# Altium project VXL_HT.PrjPCB
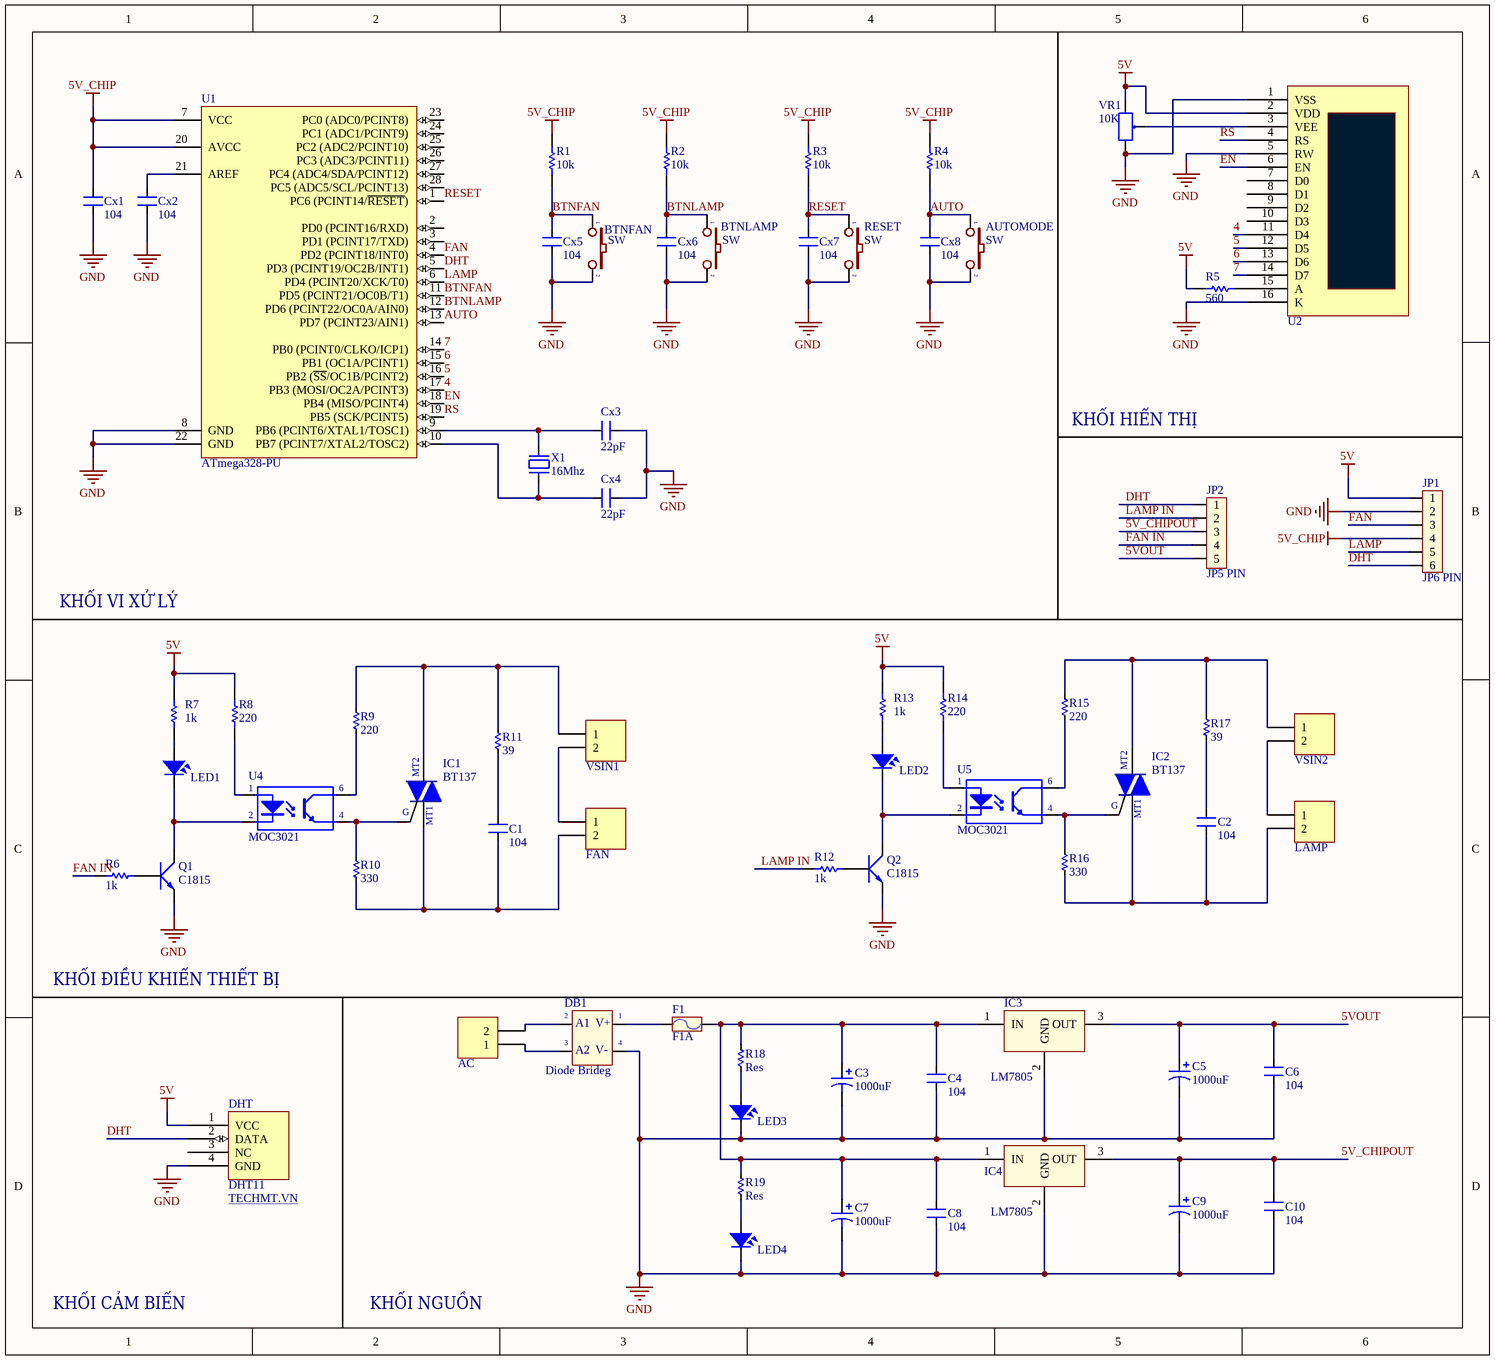
[diagram p0: VXL_HT.SchDoc]
1 sheet, 67 parts. Net scope: global (net labels, ports and power ports of the same name join across sheets).
Board file: PCB1.PcbDoc

## Sheet VXL_HT.SchDoc
size 279 x 254 mm

### Parts
AC  Header 2_1  [HED2]  (value not drawn)
AUTOMODE  SW  [SW2]
BTNFAN  SW  [SW2]
BTNLAMP  SW  [SW2]
C1  104  [CN2]
C2  104  [CN2]
C3  1000uF  [C10mm]
C4  104  [CN2]
C5  1000uF  [C10mm]
C6  104  [CN2]
C7  1000uF  [C10mm]
C8  104  [CN2]
C9  1000uF  [C10mm]
C10  104  [CN2]
Cx1  104  [CN2]
Cx2  104  [CN2]
Cx3  22pF  [CN2]
Cx4  22pF  [CN2]
Cx5  104  [CN2]
Cx6  104  [CN2]
Cx7  104  [CN2]
Cx8  104  [CN2]
DB1  Diode Brideg  [DIO-Bri 5A]
DHT  DHT11  WEB: TECHMT.VN  [DHT11]
F1  F1A  [Fuse]
FAN  Header 2_1  [HED2]  (value not drawn)
IC1  BT137  [QTO-220]
IC2  BT137  [QTO-220]
IC3  LM7805  [QTO-220]
IC4  LM7805  [QTO-220]
JP1  JP6 PIN  [JP6_1]
JP2  JP5 PIN  [JP5]
LAMP  Header 2_1  [HED2]  (value not drawn)
LED1  LED  [LED-5MM-WHITE]  (value not drawn)
LED2  LED  [LED-5MM-WHITE]  (value not drawn)
LED3  LED  [LED-5MM-YELLOW]  (value not drawn)
LED4  LED  [LED-5MM-YELLOW]  (value not drawn)
Q1  C1815  [QTO-92]
Q2  C1815  [QTO-92]
R1  value 10k  [R1/4W]  (hidden comment: Res1)
R2  value 10k  [R1/4W]  (hidden comment: Res1)
R3  value 10k  [R1/4W]  (hidden comment: Res1)
R4  value 10k  [R1/4W]  (hidden comment: Res1)
R5  value 560  [R1/4W]  (hidden comment: Res1)
R6  value 1k  [R1/4W]  (hidden comment: Res1)
R7  value 1k  [R1/4W]  (hidden comment: Res1)
R8  value 220  [R1/4W]  (hidden comment: Res1)
R9  220  [RES-1W]
R10  330  [RES-1W]
R11  39  [RES-1W]
R12  value 1k  [R1/4W]  (hidden comment: Res1)
R13  value 1k  [R1/4W]  (hidden comment: Res1)
R14  value 220  [R1/4W]  (hidden comment: Res1)
R15  220  [RES-1W]
R16  330  [RES-1W]
R17  39  [RES-1W]
R18  Res  [RES-1W]
R19  Res  [RES-1W]
RESET  SW  [SW2]
U1  ATmega328-PU  [DIP28]
U2  LCD  [LCD16X2]  (value not drawn)
U4  MOC3021  [DIP6]
U5  MOC3021  [DIP6]
VR1  10K  [VR1]
VSIN1  Header 2_1  [HED2]  (value not drawn)
VSIN2  Header 2_1  [HED2]  (value not drawn)
X1  16Mhz  [CRYSTAL]

### Nets
5V: DHT.1(VCC) JP1.1 R5.2 R7.2 R8.2 R13.2 R14.2 U2.2(VDD) VR1.1
5V_CHIP: Cx1.2 JP1.4 R1.2 R2.2 R3.2 R4.2 U1.7(VCC) U1.20(AVCC)
GND: AUTOMODE.2 BTNFAN.2 BTNLAMP.2 C3.2 C4.1 C5.2 C6.1 C7.2 C8.1 C9.2 C10.1 Cx1.1 Cx2.1 Cx3.2 Cx4.2 Cx5.1 Cx6.1 Cx7.1 Cx8.1 DB1.4(-V_OUT) DHT.4(GND) IC3.2(GND) IC4.2(GND) JP1.2 LED3.2 LED4.2 Q1.1(E) Q2.1(E) RESET.2 U1.8(GND) U1.22(GND) U2.1(VSS) U2.5(RW) U2.16(K) VR1.3
4: U1.17(PB3_(MOSI/OC2A/PCINT3)) U2.11(D4)
5: U1.16(PB2_(~{SS}/OC1B/PCINT2)) U2.12(D5)
5V_CHIPOUT: C9.1 C10.2 IC4.3(OUT) JP2.3
5VOUT: C5.1 C6.2 IC3.3(OUT) JP2.5
6: U1.15(PB1_(OC1A/PCINT1)) U2.13(D6)
7: U1.14(PB0_(PCINT0/CLKO/ICP1)) U2.14(D7)
AUTO: AUTOMODE.1 Cx8.2 R4.1 U1.13(PD7_(PCINT23/AIN1))
BTNFAN: BTNFAN.1 Cx5.2 R1.1 U1.11(PD5_(PCINT21/OC0B/T1))
BTNLAMP: BTNLAMP.1 Cx6.2 R2.1 U1.12(PD6_(PCINT22/OC0A/AIN0))
DHT: DHT.2(DATA) JP1.6 JP2.1 U1.5(PD3_(PCINT19/OC2B/INT1))
EN: U1.18(PB4_(MISO/PCINT4)) U2.6(EN)
FAN: JP1.3 U1.4(PD2_(PCINT18/INT0))
FAN IN: JP2.4 R6.2
LAMP: JP1.5 U1.6(PD4_(PCINT20/XCK/T0))
LAMP IN: JP2.2 R12.2
RESET: Cx7.2 R3.1 RESET.1 U1.1(PC6_(PCINT14/~{RESET}))
RS: U1.19(PB5_(SCK/PCINT5)) U2.4(RS)
NetAC_1: AC.1 DB1.3(AC2)
NetAC_2: AC.2 DB1.2(AC1)
NetC1_1: C1.1 FAN.2 IC1.1(MT1) R10.2
NetC1_2: C1.2 R11.2
NetC2_1: C2.1 IC2.1(MT1) LAMP.2 R16.2
NetC2_2: C2.2 R17.2
NetC3_1: C3.1 C4.2 C7.1 C8.2 F1.2 IC3.1(IN) IC4.1(IN) R18.1 R19.1
NetCx2_2: Cx2.2 U1.21(AREF)
NetCx3_1: Cx3.1 U1.9(PB6_(PCINT6/XTAL1/TOSC1)) X1.2
NetCx4_1: Cx4.1 U1.10(PB7_(PCINT7/XTAL2/TOSC2)) X1.1
NetDB1_1: DB1.1(+V_OUT) F1.1
NetFAN_1: FAN.1 VSIN1.2
NetIC1_2: IC1.2(MT2) R9.1 R11.1 VSIN1.1
NetIC1_3: IC1.3(IN) R10.1 U4.4(E)
NetIC2_2: IC2.2(MT2) R15.1 R17.1 VSIN2.1
NetIC2_3: IC2.3(IN) R16.1 U5.4(E)
NetLAMP_1: LAMP.1 VSIN2.2
NetLED1_1: LED1.1 R7.1
NetLED1_2: LED1.2 Q1.2(C) U4.2(K)
NetLED2_1: LED2.1 R13.1
NetLED2_2: LED2.2 Q2.2(C) U5.2(K)
NetLED3_1: LED3.1 R18.2
NetLED4_1: LED4.1 R19.2
NetQ1_3: Q1.3(B) R6.1
NetQ2_3: Q2.3(B) R12.1
NetR5_1: R5.1 U2.15(A)
NetR8_1: R8.1 U4.1(A)
NetR9_2: R9.2 U4.6(C)
NetR14_1: R14.1 U5.1(A)
NetR15_2: R15.2 U5.6(C)
NetU2_3: U2.3(VEE) VR1.2

Not connected (* = marked no-connect by the designer): DHT 3(NC); U1 2(PD0_(PCINT16/RXD)) 3(PD1_(PCINT17/TXD)) 23(PC0_(ADC0/PCINT8)) 24(PC1_(ADC1/PCINT9)) 25(PC2_(ADC2/PCINT10)) 26(PC3_(ADC3/PCINT11)) 27(PC4_(ADC4/SDA/PCINT12)) 28(PC5_(ADC5/SCL/PCINT13)); U2 7(D0) 8(D1) 9(D2) 10(D3)

### Notes on the sheet
- KHỐI HIỂN THỊ
- KHỐI VI XỬ LÝ
- KHỐI ĐIỀU KHIỂN THIẾT BỊ
- KHỐI CẢM BIẾN
- KHỐI NGUỒN
- (in symbol BT137) G
- (in symbol DIODE BRIGDE) A1; V+; A2; V-

### Library data of the parts
AC FAN LAMP VSIN1 VSIN2 = Header 2_1: Header, 2-Pin; Manufacturer: Generic Components; Class: Connector; Value: Header 2
AUTOMODE BTNFAN BTNLAMP RESET = SW2: Switch button 2 pin; Value: SW chip 2 pin
C1 C2 C4 C6 C8 C10 Cx1-Cx8 = CN2: Cap np 104 => 105pF; Value: 0.1uF
C3 C5 C7 C9 = Cap Pol: Polarized Capacitor (Axial); Published: 8-Jun-2000; LatestRevisionDate: 17-Jul-2002; LatestRevisionNote: Re-released for DXP Platform.; PackageReference: POLAR0.8; Publisher: Altium Limited
DB1 = DIODE BRIGDE: Convert AC to DC voltage, 4 pin; Value: Cau 1A
DHT = DHT11_1: Size: 15mm x 12mm x 5.5mm.
F1 = Fuse: Designed by: VanDungEvn; Value: Fuse
IC1 IC2 = BT137: Triacs - 8A; Value: LM317
IC3 IC4 = LM78xx: On ap +, from + 5 to + 24VDC; Value: LM7805
JP1 = JP6: Value: JP7
JP2 = JP5: Value: JP5
LED1-LED4 = LED: LED Single colour Green and Red; Value: LED 3 ly Single Colour
Q1 Q2 = C1815: NPN 600mW, ECB; Value: C1815
R1-R8 R12-R14 = Res1_1: Resistor; Manufacturer: Generic Components; Class: Passive; Published: 08/06/2000; Publisher: Altium Hobart Technology Centre; SubClass: Resistor
R9-R11 R15-R19 = Res: Manufacturer: Generic Components; Class: Passive; SubClass: R; Published: 08/06/2000; Publisher: Altium Hobart Technology Centre
U1 = ATmega328-PU: 8-bit AVR Microcontroller, 32KB Flash, 1KB EEPROM, 2KB SRAM, 28-pin PDIP, Industrial Grade (-40°C to 85°C); Published: 1-Apr-2010; DatasheetVersion: revA, Jan-2010; PackageVersion: revB, Sep-2001; PackageReference: 28P3; Publisher: Altium Limited; PackageDescription: 28-lead (0.300"/7.62mm Wide) Plastic Dual Inline Package (PDIP); Supplier 1: Digi-Key; Supplier Part Number 1: ATMEGA328-PU-ND; Supplier 2: Mouser; Supplier Part Number 2: 556-ATMEGA328-PU; ComponentLink1Description: Manufacturer Link; ComponentLink1URL: http://www.atmel.com/products/avr/default.asp?; ComponentLink2Description: ATmega48A/48PA/88A/88PA/168A/168PA/328/328P Datasheet; ComponentLink2URL: http://www.atmel.com/dyn/resources/prod_documents/8271.pdf; ComponentLink3Description: ATmega48A/48PA/88A/88PA/168A/168PA/328/328P Summary; ComponentLink3URL: http://www.atmel.com/dyn/resources/prod_documents/8271S.pdf; ComponentLink4Description: Atmel.com Home; ComponentLink4URL: http://www.atmel.com
U2 = LCD: Value: LCD16x2
U4 U5 = MOC3021: Single Opto; Value: MOC3021
VR1 = Var Resitor: Var Resistor; Value: VR 10K
X1 = CRYSTAL: Crystal For all Crystal 2pin.; Value: 4Mhz